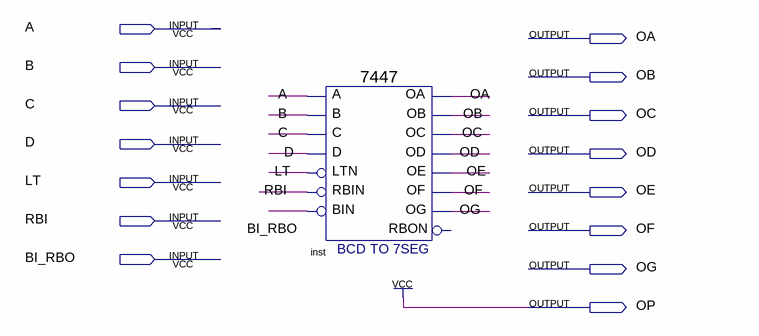
[diagram p0: schematic sheet]
// Quartus schematic BCD_seven_seg_seven_four_four_seven.bdf as structural Verilog: 1 symbols, 15 pins
module BCD_seven_seg_seven_four_four_seven (
  input  A,
  input  B,
  input  C,
  input  D,
  input  LT,
  input  RBI,
  input  BI_RBO,
  output OA,
  output OB,
  output OC,
  output OD,
  output OE,
  output OF,
  output OG,
  output OP
);

  \7447  inst (
    .LTN(LT), .B(B), .C(C), .D(D), .RBIN(RBI), .BIN(BI_RBO), .A(A), .OB(OB), .OC(OC), .OE(OE), .OD(OD),
    .OF(OF), .OG(OG), .OA(OA));  // open: RBON

  assign OP = 1'b1;
endmodule
